# EAGLE board W952 (EAGLE 6.6.0), part 1 of 2
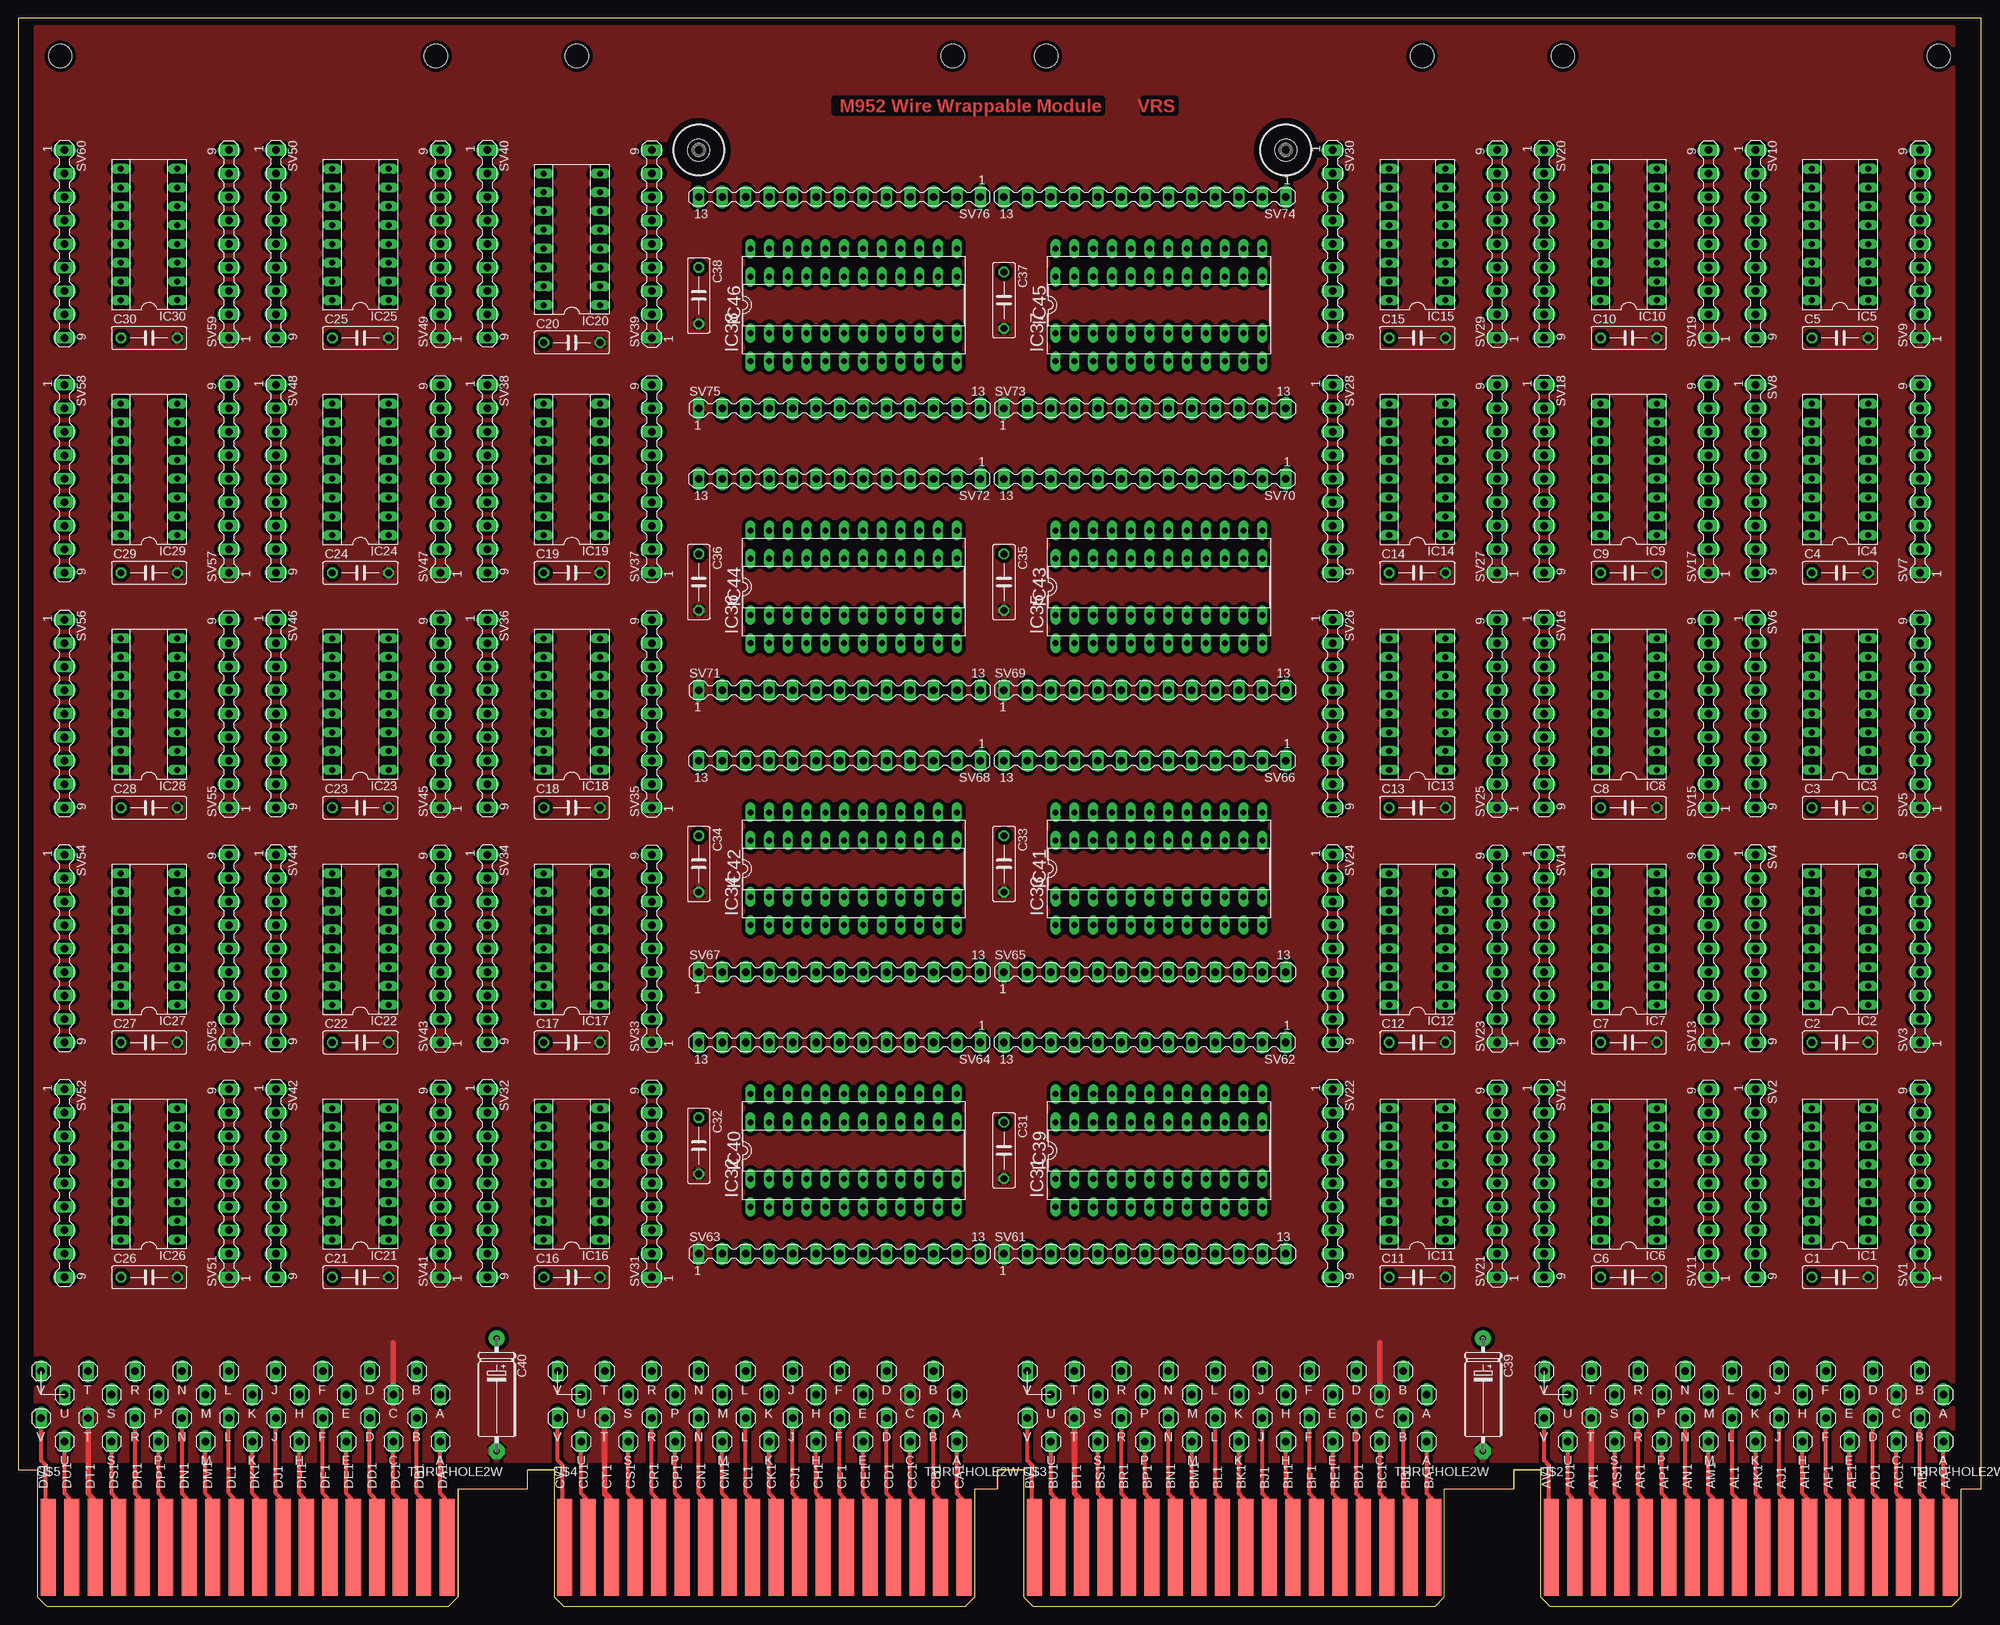
[diagram p1: board, top side]
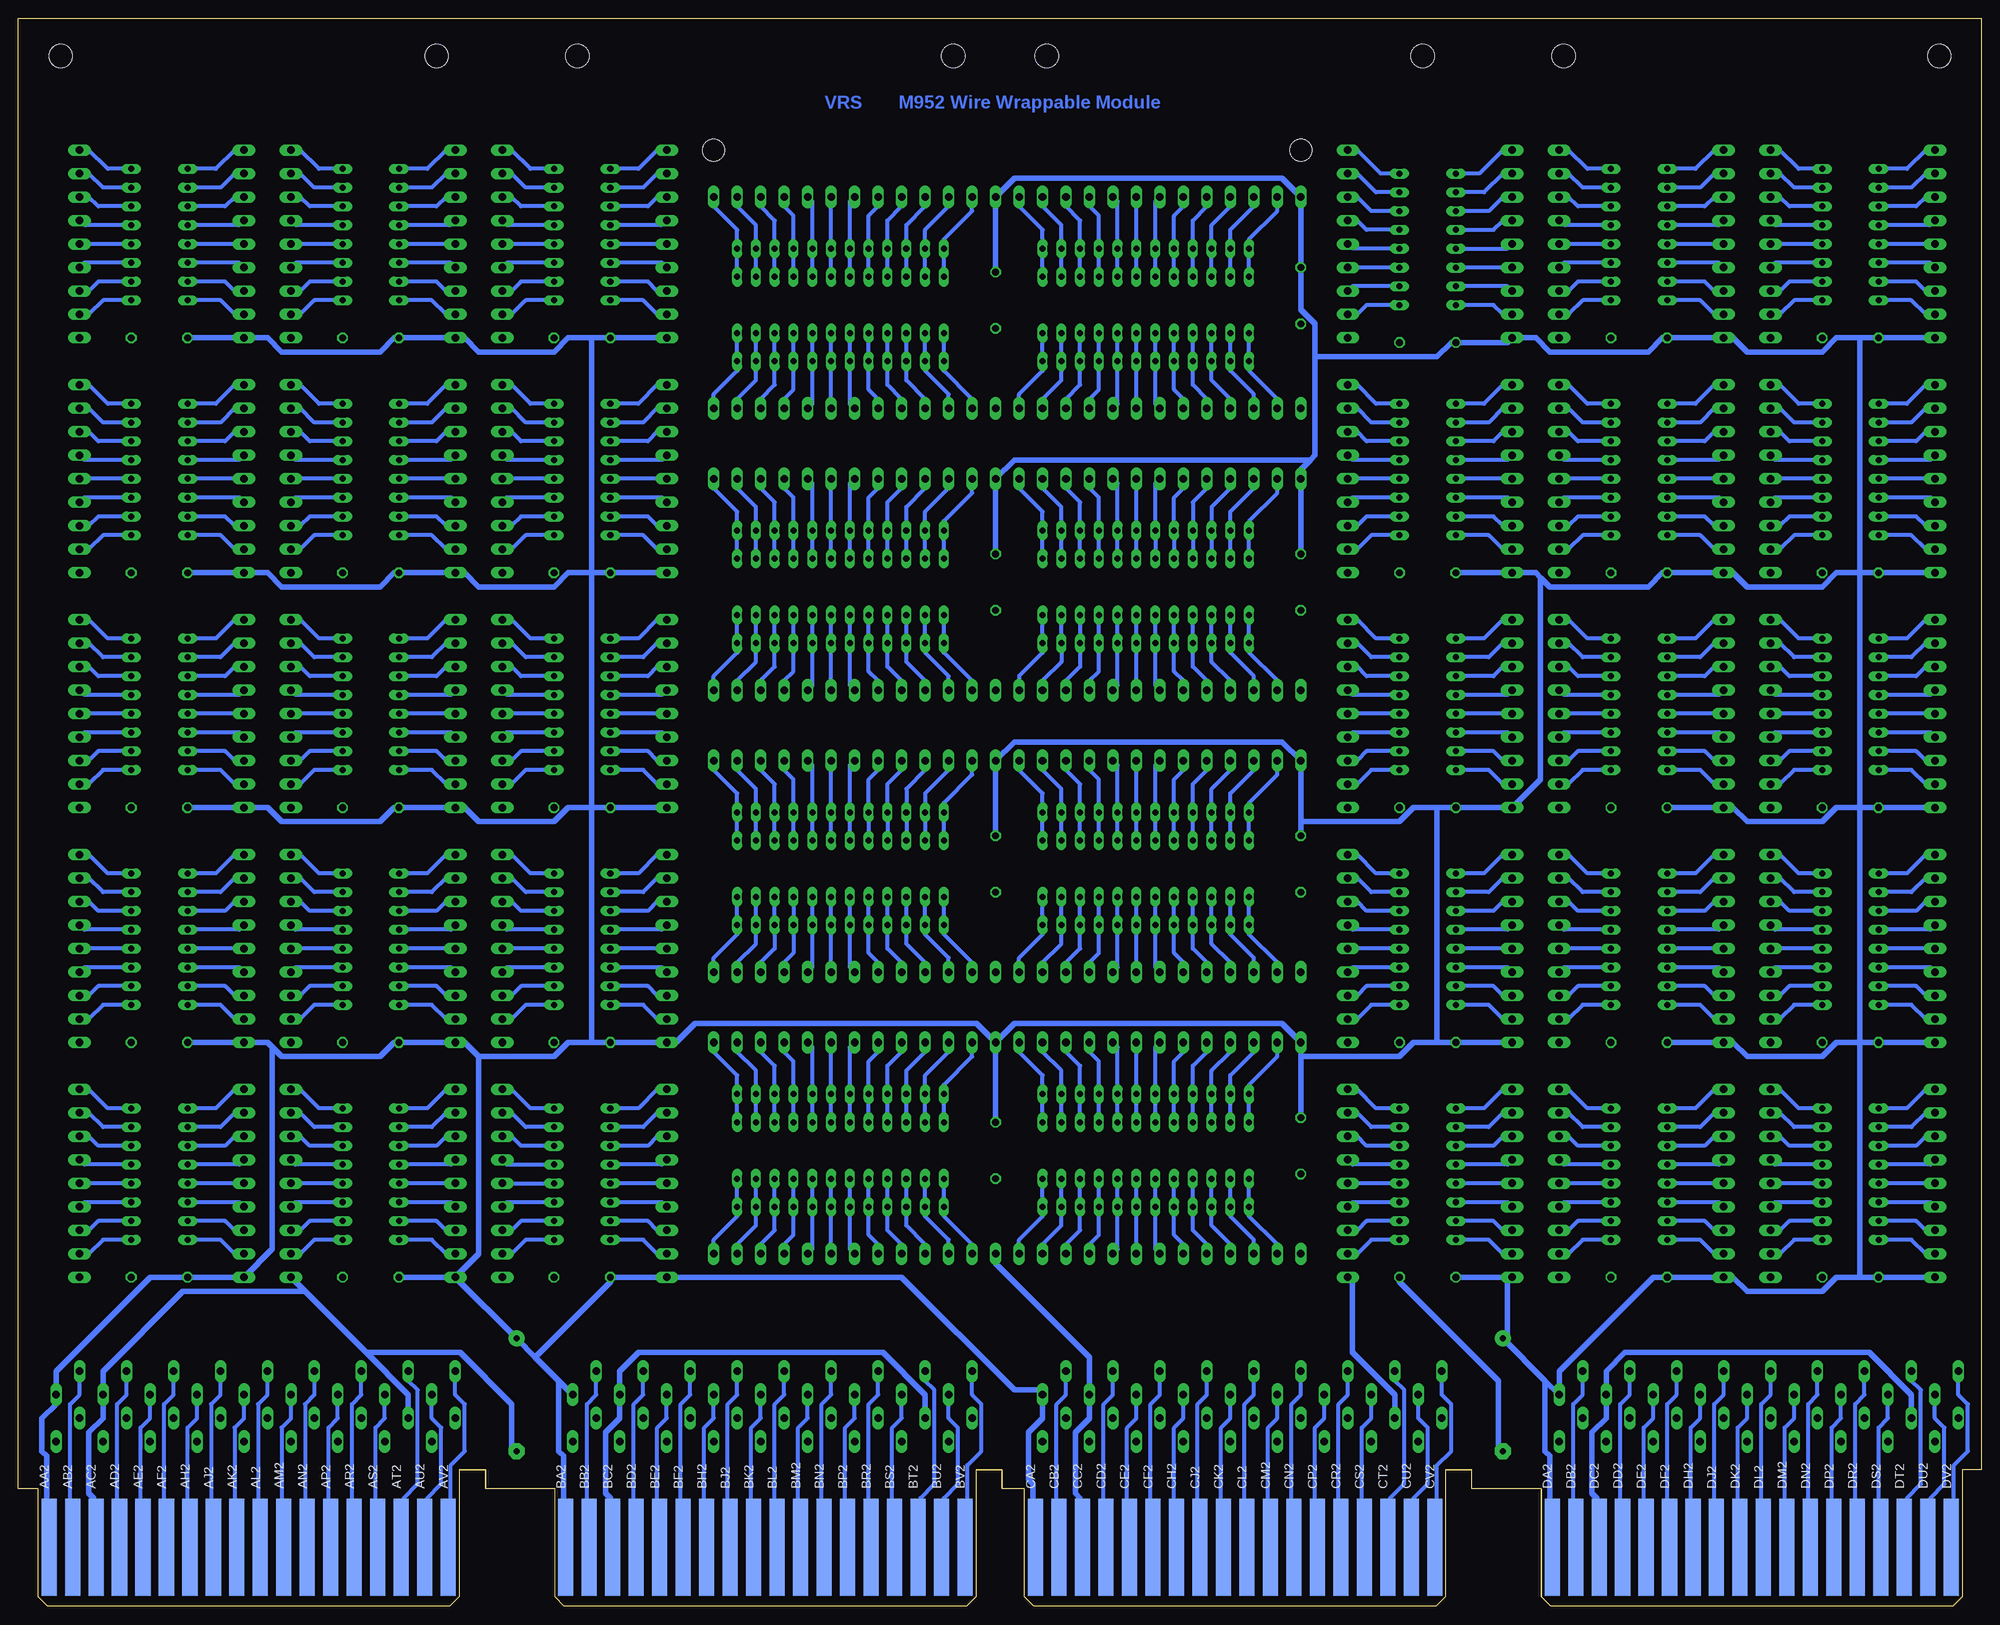
[diagram p2: board, bottom side, seen from below]

Size 265.3 x 214.63 mm. Coordinates in mm from the lower left corner, seen from the top.
Copper layers (1+16): Top 0.035mm / dielectric 1.5mm / Bottom 0.035mm
Design rules "16mils": minimum track width 16mil, minimum drill 32mil, track to track 15mil, track to pad 10mil, pad to pad 10mil, via to via 10mil, smd to smd 10mil, copper to edge 13mil, drill to drill 10mil, minimum pad ring 10mil, minimum via ring 8mil, stop-mask expansion 0mil, vias tented up to drill 0mil, thermal gap 10mil
Net classes: 0 default: width 0.508 mm; 1 supply: width 0.762 mm

## Footprints (pad centres in the part's own frame; a part is rotated, then mirrored left to right if it is on the bottom)
C075-032X103 = drill 0.914 octagon: 1 -3.81,0; 2 3.81,0
E15-5 = drill 0.813 pad 2.159: + -7.62,0 | drill 0.813 pad 2.159 octagon: - 7.62,0
SOCKET-16 = drill 0.813 long: 1 -8.89,-3.81; 2 -6.35,-3.81; 3 -3.81,-3.81; 4 -1.27,-3.81; 5 1.27,-3.81; 6 3.81,-3.81; 7 6.35,-3.81; 8 8.89,-3.81; 9 8.89,3.81; 10 6.35,3.81; 11 3.81,3.81; 12 1.27,3.81; 13 -1.27,3.81; 14 -3.81,3.81; 15 -6.35,3.81; 16 -8.89,3.81
DIL24-6 = drill 0.813 long: 1 -13.97,-7.62; 2 -11.43,-7.62; 3 -8.89,-7.62; 4 -6.35,-7.62; 5 -3.81,-7.62; 6 -1.27,-7.62; 7 1.27,-7.62; 8 3.81,-7.62; 9 6.35,-7.62; 10 8.89,-7.62; 11 11.43,-7.62; 12 13.97,-7.62; 13 13.97,7.62; 14 11.43,7.62; 15 8.89,7.62; 16 6.35,7.62; 17 3.81,7.62; 18 1.27,7.62; 19 -1.27,7.62; 20 -3.81,7.62; 21 -6.35,7.62; 22 -8.89,7.62; 23 -11.43,7.62; 24 -13.97,7.62
DIL24-3 = drill 0.813 long: 1 -13.97,-3.81; 2 -11.43,-3.81; 3 -8.89,-3.81; 4 -6.35,-3.81; 5 -3.81,-3.81; 6 -1.27,-3.81; 7 1.27,-3.81; 8 3.81,-3.81; 9 6.35,-3.81; 10 8.89,-3.81; 11 11.43,-3.81; 12 13.97,-3.81; 13 13.97,3.81; 14 11.43,3.81; 15 8.89,3.81; 16 6.35,3.81; 17 3.81,3.81; 18 1.27,3.81; 19 -1.27,3.81; 20 -3.81,3.81; 21 -6.35,3.81; 22 -8.89,3.81; 23 -11.43,3.81; 24 -13.97,3.81
MA09-1 = drill 1.016 long: 1 -12.7,0; 2 -9.525,0; 3 -6.35,0; 4 -3.175,0; 5 0,0; 6 3.175,0; 7 6.35,0; 8 9.525,0; 9 12.7,0
MA13-1 = drill 1.016 long: 1 -19.05,0; 2 -15.875,0; 3 -12.7,0; 4 -9.525,0; 5 -6.35,0; 6 -3.175,0; 7 0,0; 8 3.175,0; 9 6.35,0; 10 9.525,0; 11 12.7,0; 12 15.875,0; 13 19.05,0
EDGE-CON8 = smd 2.032 x 13.106: AA1 261.303,7.938; AB1 258.127,7.938; AC1 254.952,7.938; AD1 251.778,7.938; AE1 248.602,7.938; AF1 245.428,7.938; AH1 242.252,7.938; AJ1 239.077,7.938; AK1 235.903,7.938; AL1 232.727,7.938; AM1 229.553,7.938; AN1 226.377,7.938; AP1 223.202,7.938; AR1 220.028,7.938; AS1 216.852,7.938; AT1 213.678,7.938; AU1 210.502,7.938; AV1 207.327,7.938; BA1 191.452,7.938; BB1 188.278,7.938; BC1 185.102,7.938; BD1 181.928,7.938; BE1 178.752,7.938; BF1 175.577,7.938; BH1 172.403,7.938; BJ1 169.227,7.938; BK1 166.053,7.938; BL1 162.877,7.938; BM1 159.702,7.938; BN1 156.528,7.938; BP1 153.352,7.938; BR1 150.178,7.938; BS1 147.002,7.938; BT1 143.827,7.938; BU1 140.653,7.938; BV1 137.477,7.938; CA1 127.953,7.938; CB1 124.778,7.938; CC1 121.603,7.938; CD1 118.427,7.938; CE1 115.252,7.938; CF1 112.078,7.938; CH1 108.903,7.938; CJ1 105.728,7.938; CK1 102.552,7.938; CL1 99.377,7.938; CM1 96.203,7.938; CN1 93.028,7.938; CP1 89.853,7.938; CR1 86.677,7.938; CS1 83.502,7.938; CT1 80.328,7.938; CU1 77.153,7.938; CV1 73.978,7.938; DA1 58.102,7.938; DB1 54.928,7.938; DC1 51.752,7.938; DD1 48.578,7.938; DE1 45.403,7.938; DF1 42.227,7.938; DH1 39.053,7.938; DJ1 35.877,7.938; DK1 32.703,7.938; DL1 29.527,7.938; DM1 26.352,7.938; DN1 23.177,7.938; DP1 20.003,7.938; DR1 16.828,7.938; DS1 13.652,7.938; DT1 10.477,7.938; DU1 7.303,7.938; DV1 4.128,7.938 | smd 2.032 x 13.106 bottom: AA2 261.303,7.938; AB2 258.127,7.938; AC2 254.952,7.938; AD2 251.778,7.938; AE2 248.602,7.938; AF2 245.428,7.938; AH2 242.252,7.938; AJ2 239.077,7.938; AK2 235.903,7.938; AL2 232.727,7.938; AM2 229.553,7.938; AN2 226.377,7.938; AP2 223.202,7.938; AR2 220.028,7.938; AS2 216.852,7.938; AT2 213.678,7.938; AU2 210.502,7.938; AV2 207.327,7.938; BA2 191.452,7.938; BB2 188.278,7.938; BC2 185.102,7.938; BD2 181.928,7.938; BE2 178.752,7.938; BF2 175.577,7.938; BH2 172.403,7.938; BJ2 169.227,7.938; BK2 166.053,7.938; BL2 162.877,7.938; BM2 159.702,7.938; BN2 156.528,7.938; BP2 153.352,7.938; BR2 150.178,7.938; BS2 147.002,7.938; BT2 143.827,7.938; BU2 140.653,7.938; BV2 137.477,7.938; CA2 127.953,7.938; CB2 124.778,7.938; CC2 121.603,7.938; CD2 118.427,7.938; CE2 115.252,7.938; CF2 112.078,7.938; CH2 108.903,7.938; CJ2 105.728,7.938; CK2 102.552,7.938; CL2 99.377,7.938; CM2 96.203,7.938; CN2 93.028,7.938; CP2 89.853,7.938; CR2 86.677,7.938; CS2 83.502,7.938; CT2 80.328,7.938; CU2 77.153,7.938; CV2 73.978,7.938; DA2 58.102,7.938; DB2 54.928,7.938; DC2 51.752,7.938; DD2 48.578,7.938; DE2 45.403,7.938; DF2 42.227,7.938; DH2 39.053,7.938; DJ2 35.877,7.938; DK2 32.703,7.938; DL2 29.527,7.938; DM2 26.352,7.938; DN2 23.177,7.938; DP2 20.003,7.938; DR2 16.828,7.938; DS2 13.652,7.938; DT2 10.477,7.938; DU2 7.303,7.938; DV2 4.128,7.938
THRU-HOLE2 = drill 1.016 long: A1 28.575,9.525; A2 28.575,3.175; B1 25.4,12.7; B2 25.4,6.35; C1 22.225,9.525; C2 22.225,3.175; D1 19.05,12.7; D2 19.05,6.35; E1 15.875,9.525; E2 15.875,3.175; F1 12.7,12.7; F2 12.7,6.35; H1 9.525,9.525; H2 9.525,3.175; J1 6.35,12.7; J2 6.35,6.35; K1 3.175,9.525; K2 3.175,3.175; L1 0,12.7; L2 0,6.35; M1 -3.175,9.525; M2 -3.175,3.175; N1 -6.35,12.7; N2 -6.35,6.35; P1 -9.525,9.525; P2 -9.525,3.175; R1 -12.7,12.7; R2 -12.7,6.35; S1 -15.875,9.525; S2 -15.875,3.175; T1 -19.05,12.7; T2 -19.05,6.35; U1 -22.225,9.525; U2 -22.225,3.175; V1 -25.4,12.7; V2 -25.4,6.35
OMNIBUS = hole 3.175: 208.915,209.55; 259.715,209.55; 189.865,209.55; 139.065,209.55; 75.616,209.55; 126.416,209.55; 56.566,209.55; 5.766,209.55
DRIL-3 = hole 3: 0,0

## Placement (x,y rotation side)
C1  [C075-032X103]  246.25,44.45 0 top
C2  [C075-032X103]  246.25,76.2 0 top
C3  [C075-032X103]  246.25,107.95 0 top
C4  [C075-032X103]  246.25,139.7 0 top
C5  [C075-032X103]  246.25,171.45 0 top
C6  [C075-032X103]  217.68,44.45 0 top
C7  [C075-032X103]  217.68,76.2 0 top
C8  [C075-032X103]  217.68,107.95 0 top
C9  [C075-032X103]  217.68,139.7 0 top
C10  [C075-032X103]  217.68,171.45 0 top
C11  [C075-032X103]  189.1,44.45 0 top
C12  [C075-032X103]  189.1,76.2 0 top
C13  [C075-032X103]  189.1,107.95 0 top
C14  [C075-032X103]  189.1,139.7 0 top
C15  [C075-032X103]  189.1,171.45 0 top
C16  [C075-032X103]  74.8,44.45 0 top
C17  [C075-032X103]  74.8,76.2 0 top
C18  [C075-032X103]  74.8,107.95 0 top
C19  [C075-032X103]  74.8,139.7 0 top
C20  [C075-032X103]  74.8,170.81 0 top
C21  [C075-032X103]  46.23,44.45 0 top
C22  [C075-032X103]  46.23,76.2 0 top
C23  [C075-032X103]  46.23,107.95 0 top
C24  [C075-032X103]  46.23,139.7 0 top
C25  [C075-032X103]  46.23,171.45 0 top
C26  [C075-032X103]  17.65,44.45 0 top
C27  [C075-032X103]  17.65,76.2 0 top
C28  [C075-032X103]  17.65,107.95 0 top
C29  [C075-032X103]  17.65,139.7 0 top
C30  [C075-032X103]  17.65,171.45 0 top
C31  [C075-032X103]  133.22,61.59 270 top
C32  [C075-032X103]  91.95,62.23 270 top
C33  [C075-032X103]  133.22,100.33 270 top
C34  [C075-032X103]  91.95,100.33 270 top
C35  [C075-032X103]  133.22,138.43 270 top
C36  [C075-032X103]  91.95,138.43 270 top
C37  [C075-032X103]  133.22,176.53 270 top
C38  [C075-032X103]  91.95,177.16 270 top
C39  [E15-5]  197.99,28.57 270 top
C40  [E15-5]  64.64,28.57 270 top
IC1  [SOCKET-16]  246.25,58.42 90 top
IC2  [SOCKET-16]  246.25,90.17 90 top
IC3  [SOCKET-16]  246.25,121.92 90 top
IC4  [SOCKET-16]  246.25,153.67 90 top
IC5  [SOCKET-16]  246.25,185.42 90 top
IC6  [SOCKET-16]  217.68,58.42 90 top
IC7  [SOCKET-16]  217.68,90.17 90 top
IC8  [SOCKET-16]  217.68,121.92 90 top
IC9  [SOCKET-16]  217.68,153.67 90 top
IC10  [SOCKET-16]  217.68,185.42 90 top
IC11  [SOCKET-16]  189.1,58.42 90 top
IC12  [SOCKET-16]  189.1,90.17 90 top
IC13  [SOCKET-16]  189.1,121.92 90 top
IC14  [SOCKET-16]  189.1,153.67 90 top
IC15  [SOCKET-16]  189.1,185.42 90 top
IC16  [SOCKET-16]  74.8,58.42 90 top
IC17  [SOCKET-16]  74.8,90.17 90 top
IC18  [SOCKET-16]  74.8,121.92 90 top
IC19  [SOCKET-16]  74.8,153.67 90 top
IC20  [SOCKET-16]  74.8,184.78 90 top
IC21  [SOCKET-16]  46.23,58.42 90 top
IC22  [SOCKET-16]  46.23,90.17 90 top
IC23  [SOCKET-16]  46.23,121.92 90 top
IC24  [SOCKET-16]  46.23,153.67 90 top
IC25  [SOCKET-16]  46.23,185.42 90 top
IC26  [SOCKET-16]  17.65,58.42 90 top
IC27  [SOCKET-16]  17.65,90.17 90 top
IC28  [SOCKET-16]  17.65,121.92 90 top
IC29  [SOCKET-16]  17.65,153.67 90 top
IC30  [SOCKET-16]  17.65,185.42 90 top
IC31  [DIL24-6]  154.18,61.59 0 top
IC32  [DIL24-6]  112.9,61.59 0 top
IC33  [DIL24-6]  154.18,99.69 0 top
IC34  [DIL24-6]  112.9,99.69 0 top
IC35  [DIL24-6]  154.18,137.79 0 top
IC36  [DIL24-6]  112.9,137.79 0 top
IC37  [DIL24-6]  154.18,175.9 0 top
IC38  [DIL24-6]  112.9,175.9 0 top
IC39  [DIL24-3]  154.18,61.59 0 top
IC40  [DIL24-3]  112.9,61.59 0 top
IC41  [DIL24-3]  154.18,99.69 0 top
IC42  [DIL24-3]  112.9,99.69 0 top
IC43  [DIL24-3]  154.18,137.79 0 top
IC44  [DIL24-3]  112.9,137.79 0 top
IC45  [DIL24-3]  154.18,175.9 0 top
IC46  [DIL24-3]  112.9,175.9 0 top
SV1  MA09-1  [MA09-1]  257.05,57.15 90 top
SV2  MA09-1  [MA09-1]  234.82,57.15 270 top
SV3  MA09-1  [MA09-1]  257.05,88.9 90 top
SV4  MA09-1  [MA09-1]  234.82,88.9 270 top
SV5  MA09-1  [MA09-1]  257.05,120.65 90 top
SV6  MA09-1  [MA09-1]  234.82,120.65 270 top
SV7  MA09-1  [MA09-1]  257.05,152.4 90 top
SV8  MA09-1  [MA09-1]  234.82,152.4 270 top
SV9  MA09-1  [MA09-1]  257.05,184.15 90 top
SV10  MA09-1  [MA09-1]  234.82,184.15 270 top
SV11  MA09-1  [MA09-1]  228.47,57.15 90 top
SV12  MA09-1  [MA09-1]  206.25,57.15 270 top
SV13  MA09-1  [MA09-1]  228.47,88.9 90 top
SV14  MA09-1  [MA09-1]  206.25,88.9 270 top
SV15  MA09-1  [MA09-1]  228.47,120.65 90 top
SV16  MA09-1  [MA09-1]  206.25,120.65 270 top
SV17  MA09-1  [MA09-1]  228.47,152.4 90 top
SV18  MA09-1  [MA09-1]  206.25,152.4 270 top
SV19  MA09-1  [MA09-1]  228.47,184.15 90 top
SV20  MA09-1  [MA09-1]  206.25,184.15 270 top
SV21  MA09-1  [MA09-1]  199.9,57.15 90 top
SV22  MA09-1  [MA09-1]  177.67,57.15 270 top
SV23  MA09-1  [MA09-1]  199.9,88.9 90 top
SV24  MA09-1  [MA09-1]  177.67,88.9 270 top
SV25  MA09-1  [MA09-1]  199.9,120.65 90 top
SV26  MA09-1  [MA09-1]  177.67,120.65 270 top
SV27  MA09-1  [MA09-1]  199.9,152.4 90 top
SV28  MA09-1  [MA09-1]  177.67,152.4 270 top
SV29  MA09-1  [MA09-1]  199.9,184.15 90 top
SV30  MA09-1  [MA09-1]  177.67,184.15 270 top
SV31  MA09-1  [MA09-1]  85.6,57.15 90 top
SV32  MA09-1  [MA09-1]  63.37,57.15 270 top
SV33  MA09-1  [MA09-1]  85.6,88.9 90 top
SV34  MA09-1  [MA09-1]  63.37,88.9 270 top
SV35  MA09-1  [MA09-1]  85.6,120.65 90 top
SV36  MA09-1  [MA09-1]  63.37,120.65 270 top
SV37  MA09-1  [MA09-1]  85.6,152.4 90 top
SV38  MA09-1  [MA09-1]  63.37,152.4 270 top
SV39  MA09-1  [MA09-1]  85.6,184.15 90 top
SV40  MA09-1  [MA09-1]  63.37,184.15 270 top
SV41  MA09-1  [MA09-1]  57.02,57.15 90 top
SV42  MA09-1  [MA09-1]  34.8,57.15 270 top
SV43  MA09-1  [MA09-1]  57.02,88.9 90 top
SV44  MA09-1  [MA09-1]  34.8,88.9 270 top
SV45  MA09-1  [MA09-1]  57.02,120.65 90 top
SV46  MA09-1  [MA09-1]  34.8,120.65 270 top
SV47  MA09-1  [MA09-1]  57.02,152.4 90 top
SV48  MA09-1  [MA09-1]  34.8,152.4 270 top
SV49  MA09-1  [MA09-1]  57.02,184.15 90 top
SV50  MA09-1  [MA09-1]  34.8,184.15 270 top
SV51  MA09-1  [MA09-1]  28.45,57.15 90 top
SV52  MA09-1  [MA09-1]  6.22,57.15 270 top
SV53  MA09-1  [MA09-1]  28.45,88.9 90 top
SV54  MA09-1  [MA09-1]  6.22,88.9 270 top
SV55  MA09-1  [MA09-1]  28.45,120.65 90 top
SV56  MA09-1  [MA09-1]  6.22,120.65 270 top
SV57  MA09-1  [MA09-1]  28.45,152.4 90 top
SV58  MA09-1  [MA09-1]  6.22,152.4 270 top
SV59  MA09-1  [MA09-1]  28.45,184.15 90 top
SV60  MA09-1  [MA09-1]  6.22,184.15 270 top
SV61  MA13-1  [MA13-1]  152.27,47.62 0 top
SV62  MA13-1  [MA13-1]  152.27,76.2 180 top
SV63  MA13-1  [MA13-1]  111,47.62 0 top
SV64  MA13-1  [MA13-1]  111,76.2 180 top
SV65  MA13-1  [MA13-1]  152.27,85.72 0 top
SV66  MA13-1  [MA13-1]  152.27,114.3 180 top
SV67  MA13-1  [MA13-1]  111,85.72 0 top
SV68  MA13-1  [MA13-1]  111,114.3 180 top
SV69  MA13-1  [MA13-1]  152.27,123.83 0 top
SV70  MA13-1  [MA13-1]  152.27,152.4 180 top
SV71  MA13-1  [MA13-1]  111,123.83 0 top
SV72  MA13-1  [MA13-1]  111,152.4 180 top
SV73  MA13-1  [MA13-1]  152.27,161.93 0 top
SV74  MA13-1  [MA13-1]  152.27,190.5 180 top
SV75  MA13-1  [MA13-1]  111,161.93 0 top
SV76  MA13-1  [MA13-1]  111,190.5 180 top
U$1  [EDGE-CON8]  -0.13,0 0 top
U$2  THRU-HOLE2W  [THRU-HOLE2]  231.65,19.05 0 top
U$3  THRU-HOLE2W  [THRU-HOLE2]  161.8,19.05 0 top
U$4  THRU-HOLE2W  [THRU-HOLE2]  98.3,19.05 0 top
U$5  THRU-HOLE2W  [THRU-HOLE2]  28.45,19.05 0 top
U$8  OUTLINE-OMNIBUS  [OMNIBUS]  -0.13,0 0 top
U$9  [DRIL-3]  91.95,196.85 0 top
U$10  [DRIL-3]  171.32,196.85 0 top

## Tracks (layer width: path | path; a pad name or v marks a point on that pad's centre or on a via)
GND
  Top 0.762: U$3.T2 142.75,15.24 143.38,14.61 U$1.BT1 | U$5.T2 9.4,15.24 10.03,14.61 U$1.DT1 | U$1.CT1 79.88,14.61 79.25,15.24 U$4.T2 | U$1.AT1 213.23,14.61 212.6,15.24 U$2.T2 | U$5.C1 50.67,35.56 | U$3.C1 184.02,35.56
  Bottom 0.762: U$1.BC2 185.29,14.61 185.93,15.24 185.93,23.5 184.02,25.4 U$3.C1 184.02,31.75 181.48,34.29 148.46,34.29 142.75,28.57 U$3.T2 | U$1.DC2 51.94,14.61 52.58,15.24 52.58,23.5 50.67,25.4 U$5.C1 50.67,31.75 48.13,34.29 15.11,34.29 9.4,28.57 U$5.T2 | U$1.AC2 255.14,14.61 255.78,15.24 255.78,23.5 253.87,25.4 U$2.C1 253.87,31.75 243.08,42.55 226.57,42.55 | U$1.CC2 121.79,14.61 122.43,15.24 122.43,23.5 120.52,25.4 U$4.C1 120.52,33.66 133.22,46.35 SV61.1 | U$4.T2 79.25,28.57 84.96,34.29 84.96,43.81 SV31.1 | 226.57,42.55 218.31,34.29 | 218.31,34.29 212.6,28.57 U$2.T2 | 226.57,42.55 SV11.1 | C40.- 65.28,21.59 65.28,30.48 78.61,43.81 C16.2 | 218.31,34.29 205.61,34.29 198.63,27.3 198.63,21.59 C39.-
  pour Top (isolate 0.508): 2.41,19.68 261.49,19.68 261.49,213.36 2.41,213.36
N$1
  Top 0.508: U$2.K2 234.82,15.24 235.46,14.61 U$1.AK1
N$2
  Top 0.508: U$2.J2 238,15.24 238.63,14.61 U$1.AJ1
N$3
  Top 0.508: U$2.H2 241.17,15.24 241.81,14.61 U$1.AH1
N$4
  Top 0.508: U$2.L2 231.65,15.24 232.28,14.61 U$1.AL1
N$5
  Top 0.508: U$2.M2 228.47,15.24 229.11,14.61 U$1.AM1
N$6
  Top 0.508: U$2.N2 225.3,15.24 225.93,14.61 U$1.AN1
N$7
  Top 0.508: U$2.P2 222.12,15.24 222.76,14.61 U$1.AP1
N$8
  Top 0.508: U$2.F2 244.35,15.24 244.98,14.61 U$1.AF1
N$9
  Top 0.508: U$2.E2 247.52,15.24 248.16,14.61 U$1.AE1
N$10
  Top 0.508: U$2.D2 250.7,15.24 251.33,14.61 U$1.AD1
N$11
  Top 0.508: U$2.C2 253.87,15.24 254.51,14.61 U$1.AC1
N$12
  Top 0.508: U$2.R2 218.95,15.24 219.58,14.61 U$1.AR1
N$13
  Top 0.508: U$2.S2 215.77,15.24 216.41,14.61 U$1.AS1
N$14
  Top 0.508: U$2.B2 257.05,15.24 257.68,14.61 U$1.AB1
N$15
  Top 0.508: U$2.A2 260.22,15.24 260.86,14.61 U$1.AA1
N$16
  Top 0.508: U$2.U2 209.42,15.24 210.06,14.61 U$1.AU1
N$17
  Top 0.508: U$2.V2 206.25,19.68 206.88,19.05 206.88,13.97 U$1.AV1
N$18
  Bottom 0.508: U$2.V1 206.25,28.57 204.98,27.3 204.98,20.95 206.88,19.05 206.88,13.97 U$1.AV2
N$19
  Bottom 0.508: U$2.U1 209.42,25.4 208.15,24.13 208.15,16.51 210.06,14.61 U$1.AU2
N$20
  Bottom 0.508: U$2.T1 212.6,30.48 211.33,29.21 211.33,16.51 213.23,14.61 U$1.AT2
N$21
  Bottom 0.508: U$2.S1 215.77,25.4 217.04,24.13 217.04,13.97 U$1.AS2
N$22
  Bottom 0.508: U$2.R1 218.95,28.57 220.22,27.3 220.22,13.97 U$1.AR2
N$23
  Bottom 0.508: U$2.P1 222.12,25.4 223.39,24.13 223.39,13.97 U$1.AP2
N$24
  Bottom 0.508: U$2.N1 225.3,28.57 226.57,27.3 226.57,13.97 U$1.AN2
N$25
  Bottom 0.508: U$2.M1 228.47,25.4 229.74,24.13 229.74,13.97 U$1.AM2
N$26
  Bottom 0.508: U$2.L1 231.65,28.57 232.92,27.3 232.92,13.97 U$1.AL2
N$27
  Bottom 0.508: U$2.K1 234.82,25.4 236.09,24.13 236.09,13.97 U$1.AK2
N$28
  Bottom 0.508: U$2.J1 238,28.57 239.27,27.3 239.27,13.97 U$1.AJ2
N$29
  Bottom 0.508: U$2.H1 241.17,25.4 242.44,24.13 242.44,13.97 U$1.AH2
N$30
  Bottom 0.508: U$2.F1 244.35,28.57 245.62,27.3 245.62,13.97 U$1.AF2
N$31
  Bottom 0.508: U$2.E1 247.52,25.4 248.79,24.13 248.79,13.97 U$1.AE2
N$32
  Bottom 0.508: U$2.D1 250.7,28.57 251.97,27.3 251.97,13.97 U$1.AD2
N$33
  Bottom 0.508: U$2.B1 257.05,28.57 258.32,27.3 258.32,13.97 U$1.AB2
N$34
  Top 0.508: U$3.V2 136.4,19.68 137.03,19.05 137.03,13.97 U$1.BV1
N$35
  Top 0.508: U$3.U2 139.57,15.24 140.21,14.61 U$1.BU1
N$36
  Top 0.508: U$3.S2 145.92,15.24 146.56,14.61 U$1.BS1
N$37
  Top 0.508: U$3.R2 149.1,15.24 149.73,14.61 U$1.BR1
N$38
  Top 0.508: U$3.P2 152.27,15.24 152.91,14.61 U$1.BP1
N$39
  Top 0.508: U$3.N2 155.45,15.24 156.08,14.61 U$1.BN1
N$40
  Top 0.508: U$3.M2 158.62,15.24 159.26,14.61 U$1.BM1
N$41
  Top 0.508: U$3.L2 161.8,15.24 162.43,14.61 U$1.BL1
N$42
  Top 0.508: U$3.K2 164.97,15.24 165.61,14.61 U$1.BK1
N$43
  Top 0.508: U$3.J2 168.15,15.24 168.78,14.61 U$1.BJ1
N$44
  Top 0.508: U$3.H2 171.32,15.24 171.96,14.61 U$1.BH1
N$45
  Top 0.508: U$3.F2 174.5,15.24 175.13,14.61 U$1.BF1
N$46
  Top 0.508: U$3.E2 177.67,15.24 178.31,14.61 U$1.BE1
N$47
  Top 0.508: U$3.D2 180.85,15.24 181.48,14.61 U$1.BD1
N$48
  Top 0.508: U$3.C2 184.02,15.24 184.66,14.61 U$1.BC1
N$49
  Top 0.508: U$3.B2 187.2,15.24 187.83,14.61 U$1.BB1
N$50
  Top 0.508: U$3.A2 190.37,15.24 191.01,14.61 U$1.BA1
N$51
  Bottom 0.508: U$3.V1 136.4,28.57 135.13,27.3 135.13,20.95 137.03,19.05 137.03,13.97 U$1.BV2
N$52
  Bottom 0.508: U$3.U1 139.57,25.4 138.3,24.13 138.3,16.51 140.21,14.61 U$1.BU2
N$53
  Bottom 0.508: U$3.T1 142.75,30.48 141.48,29.21 141.48,16.51 143.38,14.61 U$1.BT2
N$54
  Bottom 0.508: U$3.S1 145.92,25.4 147.19,24.13 147.19,13.97 U$1.BS2
N$55
  Bottom 0.508: U$3.R1 149.1,28.57 150.37,27.3 150.37,13.97 U$1.BR2
N$56
  Bottom 0.508: U$3.P1 152.27,25.4 153.54,24.13 153.54,13.97 U$1.BP2
N$57
  Bottom 0.508: U$3.N1 155.45,28.57 156.72,27.3 156.72,13.97 U$1.BN2
N$58
  Bottom 0.508: U$3.M1 158.62,25.4 159.89,24.13 159.89,13.97 U$1.BM2
N$59
  Bottom 0.508: U$3.L1 161.8,28.57 163.07,27.3 163.07,13.97 U$1.BL2
N$60
  Bottom 0.508: U$3.K1 164.97,25.4 166.24,24.13 166.24,13.97 U$1.BK2
N$61
  Bottom 0.508: U$3.J1 168.15,28.57 169.42,27.3 169.42,13.97 U$1.BJ2
N$62
  Bottom 0.508: U$3.H1 171.32,25.4 172.59,24.13 172.59,13.97 U$1.BH2
N$63
  Bottom 0.508: U$3.F1 174.5,28.57 175.77,27.3 175.77,13.97 U$1.BF2
N$64
  Bottom 0.508: U$3.E1 177.67,25.4 178.94,24.13 178.94,13.97 U$1.BE2
N$65
  Bottom 0.508: U$3.D1 180.85,28.57 182.12,27.3 182.12,13.97 U$1.BD2
N$66
  Bottom 0.508: U$3.B1 187.2,28.57 188.47,27.3 188.47,13.97 U$1.BB2
N$67
  Top 0.508: U$4.V2 72.9,19.68 73.53,19.05 73.53,13.97 U$1.CV1
N$68
  Top 0.508: U$4.U2 76.07,15.24 76.71,14.61 U$1.CU1
N$69
  Top 0.508: U$4.S2 82.42,15.24 83.06,14.61 U$1.CS1
N$70
  Top 0.508: U$4.R2 85.6,15.24 86.23,14.61 U$1.CR1
N$71
  Top 0.508: U$4.P2 88.77,15.24 89.41,14.61 U$1.CP1
N$72
  Top 0.508: U$4.N2 91.95,15.24 92.58,14.61 U$1.CN1
N$73
  Top 0.508: U$4.M2 95.12,15.24 95.76,14.61 U$1.CM1
N$74
  Top 0.508: U$4.L2 98.3,15.24 98.93,14.61 U$1.CL1
N$75
  Top 0.508: U$4.K2 101.47,15.24 102.11,14.61 U$1.CK1
N$76
  Top 0.508: U$4.J2 104.65,15.24 105.28,14.61 U$1.CJ1
N$77
  Top 0.508: U$4.H2 107.82,15.24 108.46,14.61 U$1.CH1
N$78
  Top 0.508: U$4.F2 111,15.24 111.63,14.61 U$1.CF1
N$79
  Top 0.508: U$4.E2 114.17,15.24 114.81,14.61 U$1.CE1
N$80
  Top 0.508: U$4.D2 117.35,15.24 117.98,14.61 U$1.CD1
N$81
  Top 0.508: U$4.C2 120.52,15.24 121.16,14.61 U$1.CC1
N$82
  Top 0.508: U$4.B2 123.7,15.24 124.33,14.61 U$1.CB1
N$83
  Top 0.508: U$4.A2 126.87,15.24 127.51,14.61 U$1.CA1
N$84
  Bottom 0.508: U$4.V1 72.9,28.57 71.63,27.3 71.63,20.95 73.53,19.05 73.53,13.97 U$1.CV2
N$85
  Bottom 0.508: U$4.U1 76.07,25.4 74.8,24.13 74.8,16.51 76.07,15.24 76.71,14.61 U$1.CU2
N$86
  Bottom 0.508: U$4.T1 79.25,30.48 77.98,29.21 77.98,16.51 79.88,14.61 U$1.CT2
N$87
  Bottom 0.508: U$4.S1 82.42,25.4 83.69,24.13 83.69,13.97 U$1.CS2
N$88
  Bottom 0.508: U$4.R1 85.6,28.57 86.87,27.3 86.87,13.97 U$1.CR2
N$89
  Bottom 0.508: U$4.P1 88.77,25.4 90.04,24.13 90.04,13.97 U$1.CP2
N$90
  Bottom 0.508: U$4.N1 91.95,28.57 93.22,27.3 93.22,13.97 U$1.CN2
N$91
  Bottom 0.508: U$4.M1 95.12,25.4 96.39,24.13 96.39,13.97 U$1.CM2
N$92
  Bottom 0.508: U$4.L1 98.3,28.57 99.57,27.3 99.57,13.97 U$1.CL2
N$93
  Bottom 0.508: U$4.K1 101.47,25.4 102.74,24.13 102.74,13.97 U$1.CK2
N$94
  Bottom 0.508: U$4.J1 104.65,28.57 105.92,27.3 105.92,13.97 U$1.CJ2
N$95
  Bottom 0.508: U$4.H1 107.82,25.4 109.09,24.13 109.09,13.97 U$1.CH2
N$96
  Bottom 0.508: U$4.F1 111,28.57 112.27,27.3 112.27,13.97 U$1.CF2
N$97
  Bottom 0.508: U$4.E1 114.17,25.4 115.44,24.13 115.44,13.97 U$1.CE2
N$98
  Bottom 0.508: U$4.D1 117.35,28.57 118.62,27.3 118.62,13.97 U$1.CD2
N$99
  Bottom 0.508: U$4.B1 123.7,28.57 124.97,27.3 124.97,13.97 U$1.CB2
N$100
  Top 0.508: U$5.V2 3.05,19.68 3.68,19.05 3.68,13.97 U$1.DV1
N$101
  Top 0.508: U$5.U2 6.22,15.24 6.86,14.61 U$1.DU1
N$102
  Top 0.508: U$5.S2 12.57,15.24 13.21,14.61 U$1.DS1
N$103
  Top 0.508: U$5.R2 15.75,15.24 16.38,14.61 U$1.DR1
N$104
  Top 0.508: U$5.P2 18.92,15.24 19.56,14.61 U$1.DP1
N$105
  Top 0.508: U$5.N2 22.1,15.24 22.73,14.61 U$1.DN1
N$106
  Top 0.508: U$5.M2 25.27,15.24 25.91,14.61 U$1.DM1
N$107
  Top 0.508: U$5.L2 28.45,15.24 29.08,14.61 U$1.DL1
N$108
  Top 0.508: U$5.K2 31.62,15.24 32.26,14.61 U$1.DK1
N$109
  Top 0.508: U$5.J2 34.8,15.24 35.43,14.61 U$1.DJ1
N$110
  Top 0.508: U$5.H2 37.97,15.24 38.61,14.61 U$1.DH1
N$111
  Top 0.508: U$5.F2 41.15,15.24 41.78,14.61 U$1.DF1
N$112
  Top 0.508: U$5.E2 44.32,15.24 44.96,14.61 U$1.DE1
N$113
  Top 0.508: U$5.D2 47.5,15.24 48.13,14.61 U$1.DD1
N$114
  Top 0.508: U$5.C2 50.67,15.24 51.31,14.61 U$1.DC1
N$115
  Top 0.508: U$5.B2 53.85,15.24 54.48,14.61 U$1.DB1
N$116
  Top 0.508: U$5.A2 57.02,15.24 57.66,14.61 U$1.DA1
N$117
  Bottom 0.508: U$5.V1 3.05,28.57 1.78,27.3 1.78,20.95 3.68,19.05 3.68,13.97 U$1.DV2
N$118
  Bottom 0.508: U$5.U1 6.22,25.4 4.95,24.13 4.95,16.51 6.86,14.61 U$1.DU2
N$119
  Bottom 0.508: U$5.T1 9.4,30.48 8.13,29.21 8.13,16.51 10.03,14.61 U$1.DT2
N$120
  Bottom 0.508: U$5.S1 12.57,25.4 13.84,24.13 13.84,13.97 U$1.DS2
N$121
  Bottom 0.508: U$5.R1 15.75,28.57 17.02,27.3 17.02,13.97 U$1.DR2
N$122
  Bottom 0.508: U$5.P1 18.92,25.4 20.19,24.13 20.19,13.97 U$1.DP2
N$123
  Bottom 0.508: U$5.N1 22.1,28.57 23.37,27.3 23.37,13.97 U$1.DN2
N$124
  Bottom 0.508: U$5.M1 25.27,25.4 26.54,24.13 26.54,13.97 U$1.DM2
N$125
  Bottom 0.508: U$5.L1 28.45,28.57 29.72,27.3 29.72,13.97 U$1.DL2
N$126
  Bottom 0.508: U$5.K1 31.62,25.4 32.89,24.13 32.89,13.97 U$1.DK2
N$127
  Bottom 0.508: U$5.J1 34.8,28.57 36.07,27.3 36.07,13.97 U$1.DJ2
N$128
  Bottom 0.508: U$5.H1 37.97,25.4 39.24,24.13 39.24,13.97 U$1.DH2
N$129
  Bottom 0.508: U$5.F1 41.15,28.57 42.42,27.3 42.42,13.97 U$1.DF2
N$130
  Bottom 0.508: U$5.E1 44.32,25.4 45.59,24.13 45.59,13.97 U$1.DE2
N$131
  Bottom 0.508: U$5.D1 47.5,28.57 48.77,27.3 48.77,13.97 U$1.DD2
N$132
  Bottom 0.508: U$5.B1 53.85,28.57 55.12,27.3 55.12,13.97 U$1.DB2
N$133
  Bottom 0.508: IC1.1 253.87,49.53 255.78,47.62 SV1.2
N$134
  Bottom 0.508: IC1.2 254.51,52.07 255.78,50.8 SV1.3
N$135
  Bottom 0.508: IC1.3 256.41,54.61 SV1.4
N$136
  Bottom 0.508: IC1.4 SV1.5
N$137
  Bottom 0.508: IC1.5 256.41,59.69 SV1.6
N$138
  Bottom 0.508: IC1.6 254.51,62.23 255.78,63.5 SV1.7
N$139
  Bottom 0.508: IC1.7 253.87,64.77 255.78,66.67 SV1.8
N$140
  Bottom 0.508: IC1.8 253.24,67.31 255.78,69.85 SV1.9
N$141
  Bottom 0.508: IC1.9 238.63,67.31 236.09,69.85 SV2.1
N$142
  Bottom 0.508: IC1.10 238,64.77 236.09,66.67 SV2.2
N$143
  Bottom 0.508: IC1.11 237.36,62.23 236.09,63.5 SV2.3
N$144
  Bottom 0.508: IC1.12 235.46,59.69 SV2.4
N$145
  Bottom 0.508: SV2.5 IC1.13
N$146
  Bottom 0.508: IC1.14 235.46,54.61 SV2.6
N$147
  Bottom 0.508: IC1.15 237.36,52.07 236.09,50.8 SV2.7
N$148
  Bottom 0.508: IC1.16 238,49.53 236.09,47.62 SV2.8
N$151
  Bottom 0.508: IC2.1 253.87,81.28 255.78,79.38 SV3.2
N$152
  Bottom 0.508: IC2.2 254.51,83.82 255.78,82.55 SV3.3
N$153
  Bottom 0.508: IC2.3 256.41,86.36 SV3.4
N$154
  Bottom 0.508: IC2.4 SV3.5
N$155
  Bottom 0.508: IC2.5 256.41,91.44 SV3.6
N$156
  Bottom 0.508: IC2.6 254.51,93.98 255.78,95.25 SV3.7
N$157
  Bottom 0.508: IC2.7 253.87,96.52 255.78,98.42 SV3.8
N$158
  Bottom 0.508: IC2.8 253.24,99.06 255.78,101.6 SV3.9
N$159
  Bottom 0.508: IC2.9 238.63,99.06 236.09,101.6 SV4.1
N$160
  Bottom 0.508: IC2.10 238,96.52 236.09,98.42 SV4.2
N$161
  Bottom 0.508: IC2.11 237.36,93.98 236.09,95.25 SV4.3
N$162
  Bottom 0.508: IC2.12 235.46,91.44 SV4.4
N$163
  Bottom 0.508: SV4.5 IC2.13
N$164
  Bottom 0.508: IC2.14 235.46,86.36 SV4.6
N$165
  Bottom 0.508: IC2.15 237.36,83.82 236.09,82.55 SV4.7
N$166
  Bottom 0.508: IC2.16 238,81.28 236.09,79.38 SV4.8
N$169
  Bottom 0.508: IC3.1 253.87,113.03 255.78,111.12 SV5.2
N$170
  Bottom 0.508: IC3.2 254.51,115.57 255.78,114.3 SV5.3
N$171
  Bottom 0.508: IC3.3 256.41,118.11 SV5.4
N$172
  Bottom 0.508: IC3.4 SV5.5
N$173
  Bottom 0.508: IC3.5 256.41,123.19 SV5.6
N$174
  Bottom 0.508: IC3.6 254.51,125.73 255.78,127 SV5.7
N$175
  Bottom 0.508: IC3.7 253.87,128.27 255.78,130.18 SV5.8
N$176
  Bottom 0.508: IC3.8 253.24,130.81 255.78,133.35 SV5.9
N$177
  Bottom 0.508: IC3.9 238.63,130.81 236.09,133.35 SV6.1
N$178
  Bottom 0.508: IC3.10 238,128.27 236.09,130.18 SV6.2
N$179
  Bottom 0.508: IC3.11 237.36,125.73 236.09,127 SV6.3
N$180
  Bottom 0.508: IC3.12 235.46,123.19 SV6.4
N$181
  Bottom 0.508: SV6.5 IC3.13
N$182
  Bottom 0.508: IC3.14 235.46,118.11 SV6.6
N$183
  Bottom 0.508: IC3.15 237.36,115.57 236.09,114.3 SV6.7
N$184
  Bottom 0.508: IC3.16 238,113.03 236.09,111.12 SV6.8
N$187
  Bottom 0.508: IC4.1 253.87,144.78 255.78,142.88 SV7.2
N$188
  Bottom 0.508: IC4.2 254.51,147.32 255.78,146.05 SV7.3
N$189
  Bottom 0.508: IC4.3 256.41,149.86 SV7.4
N$190
  Bottom 0.508: IC4.4 SV7.5
N$191
  Bottom 0.508: IC4.5 256.41,154.94 SV7.6
N$192
  Bottom 0.508: IC4.6 254.51,157.48 255.78,158.75 SV7.7
N$193
  Bottom 0.508: IC4.7 253.87,160.02 255.78,161.93 SV7.8
N$194
  Bottom 0.508: IC4.8 253.24,162.56 255.78,165.1 SV7.9
N$195
  Bottom 0.508: IC4.9 238.63,162.56 236.09,165.1 SV8.1
N$196
  Bottom 0.508: IC4.10 238,160.02 236.09,161.93 SV8.2
N$197
  Bottom 0.508: IC4.11 237.36,157.48 236.09,158.75 SV8.3
N$198
  Bottom 0.508: IC4.12 235.46,154.94 SV8.4
N$199
  Bottom 0.508: SV8.5 IC4.13
N$200
  Bottom 0.508: IC4.14 235.46,149.86 SV8.6
N$201
  Bottom 0.508: IC4.15 237.36,147.32 236.09,146.05 SV8.7
N$202
  Bottom 0.508: IC4.16 238,144.78 236.09,142.88 SV8.8
N$205
  Bottom 0.508: IC5.1 253.87,176.53 255.78,174.62 SV9.2
N$206
  Bottom 0.508: IC5.2 254.51,179.07 255.78,177.8 SV9.3
N$207
  Bottom 0.508: IC5.3 256.41,181.61 SV9.4
N$208
  Bottom 0.508: IC5.4 SV9.5
N$209
  Bottom 0.508: IC5.5 256.41,186.69 SV9.6
N$210
  Bottom 0.508: IC5.6 254.51,189.23 255.78,190.5 SV9.7
N$211
  Bottom 0.508: IC5.7 253.87,191.77 255.78,193.68 SV9.8
N$212
  Bottom 0.508: IC5.8 253.24,194.31 255.78,196.85 SV9.9
N$213
  Bottom 0.508: IC5.9 238.63,194.31 236.09,196.85 SV10.1
N$214
  Bottom 0.508: IC5.10 238,191.77 236.09,193.68 SV10.2
N$215
  Bottom 0.508: IC5.11 237.36,189.23 236.09,190.5 SV10.3
N$216
  Bottom 0.508: IC5.12 235.46,186.69 SV10.4
N$217
  Bottom 0.508: SV10.5 IC5.13
N$218
  Bottom 0.508: IC5.14 235.46,181.61 SV10.6
N$219
  Bottom 0.508: IC5.15 237.36,179.07 236.09,177.8 SV10.7
N$220
  Bottom 0.508: IC5.16 238,176.53 236.09,174.62 SV10.8
N$223
  Bottom 0.508: IC6.1 225.3,49.53 227.2,47.62 SV11.2
N$224
  Bottom 0.508: IC6.2 225.93,52.07 227.2,50.8 SV11.3
N$225
  Bottom 0.508: IC6.3 227.84,54.61 SV11.4
N$226
  Bottom 0.508: IC6.4 SV11.5
N$227
  Bottom 0.508: IC6.5 227.84,59.69 SV11.6
N$228
  Bottom 0.508: IC6.6 225.93,62.23 227.2,63.5 SV11.7
N$229
  Bottom 0.508: IC6.7 225.3,64.77 227.2,66.67 SV11.8
N$230
  Bottom 0.508: IC6.8 224.66,67.31 227.2,69.85 SV11.9
N$231
  Bottom 0.508: IC6.9 210.06,67.31 207.52,69.85 SV12.1
N$232
  Bottom 0.508: IC6.10 209.42,64.77 207.52,66.67 SV12.2
N$233
  Bottom 0.508: IC6.11 208.79,62.23 207.52,63.5 SV12.3
N$234
  Bottom 0.508: IC6.12 206.88,59.69 SV12.4
N$235
  Bottom 0.508: SV12.5 IC6.13
N$236
  Bottom 0.508: IC6.14 206.88,54.61 SV12.6
N$237
  Bottom 0.508: IC6.15 208.79,52.07 207.52,50.8 SV12.7
N$238
  Bottom 0.508: IC6.16 209.42,49.53 207.52,47.62 SV12.8
N$241
  Bottom 0.508: IC7.1 225.3,81.28 227.2,79.38 SV13.2
N$242
  Bottom 0.508: IC7.2 225.93,83.82 227.2,82.55 SV13.3
N$243
  Bottom 0.508: IC7.3 227.84,86.36 SV13.4
N$244
  Bottom 0.508: IC7.4 SV13.5
N$245
  Bottom 0.508: IC7.5 227.84,91.44 SV13.6
N$246
  Bottom 0.508: IC7.6 225.93,93.98 227.2,95.25 SV13.7
N$247
  Bottom 0.508: IC7.7 225.3,96.52 227.2,98.42 SV13.8
N$248
  Bottom 0.508: IC7.8 224.66,99.06 227.2,101.6 SV13.9
N$249
  Bottom 0.508: IC7.9 210.06,99.06 207.52,101.6 SV14.1
N$250
  Bottom 0.508: IC7.10 209.42,96.52 207.52,98.42 SV14.2
N$251
  Bottom 0.508: IC7.11 208.79,93.98 207.52,95.25 SV14.3
N$252
  Bottom 0.508: IC7.12 206.88,91.44 SV14.4
N$253
  Bottom 0.508: SV14.5 IC7.13
N$254
  Bottom 0.508: IC7.14 206.88,86.36 SV14.6
N$255
  Bottom 0.508: IC7.15 208.79,83.82 207.52,82.55 SV14.7
N$256
  Bottom 0.508: IC7.16 209.42,81.28 207.52,79.38 SV14.8
N$259
  Bottom 0.508: IC8.1 225.3,113.03 227.2,111.12 SV15.2
N$260
  Bottom 0.508: IC8.2 225.93,115.57 227.2,114.3 SV15.3
N$261
  Bottom 0.508: IC8.3 227.84,118.11 SV15.4
N$262
  Bottom 0.508: IC8.4 SV15.5
N$263
  Bottom 0.508: IC8.5 227.84,123.19 SV15.6
N$264
  Bottom 0.508: IC8.6 225.93,125.73 227.2,127 SV15.7
N$265
  Bottom 0.508: IC8.7 225.3,128.27 227.2,130.18 SV15.8
N$266
  Bottom 0.508: IC8.8 224.66,130.81 227.2,133.35 SV15.9
N$267
  Bottom 0.508: IC8.9 210.06,130.81 207.52,133.35 SV16.1
N$268
  Bottom 0.508: IC8.10 209.42,128.27 207.52,130.18 SV16.2
N$269
  Bottom 0.508: IC8.11 208.79,125.73 207.52,127 SV16.3
N$270
  Bottom 0.508: IC8.12 206.88,123.19 SV16.4
N$271
  Bottom 0.508: SV16.5 IC8.13
N$272
  Bottom 0.508: IC8.14 206.88,118.11 SV16.6
N$273
  Bottom 0.508: IC8.15 208.79,115.57 207.52,114.3 SV16.7
N$274
  Bottom 0.508: IC8.16 209.42,113.03 207.52,111.12 SV16.8
N$277
  Bottom 0.508: IC9.1 225.3,144.78 227.2,142.88 SV17.2
N$278
  Bottom 0.508: IC9.2 225.93,147.32 227.2,146.05 SV17.3
N$279
  Bottom 0.508: IC9.3 227.84,149.86 SV17.4
N$280
  Bottom 0.508: IC9.4 SV17.5
N$281
  Bottom 0.508: IC9.5 227.84,154.94 SV17.6
N$282
  Bottom 0.508: IC9.6 225.93,157.48 227.2,158.75 SV17.7
N$283
  Bottom 0.508: IC9.7 225.3,160.02 227.2,161.93 SV17.8
N$284
  Bottom 0.508: IC9.8 224.66,162.56 227.2,165.1 SV17.9
N$285
  Bottom 0.508: IC9.9 210.06,162.56 207.52,165.1 SV18.1
N$286
  Bottom 0.508: IC9.10 209.42,160.02 207.52,161.93 SV18.2
N$287
  Bottom 0.508: IC9.11 208.79,157.48 207.52,158.75 SV18.3
N$288
  Bottom 0.508: IC9.12 206.88,154.94 SV18.4
N$289
  Bottom 0.508: SV18.5 IC9.13
N$290
  Bottom 0.508: IC9.14 206.88,149.86 SV18.6
N$291
  Bottom 0.508: IC9.15 208.79,147.32 207.52,146.05 SV18.7
N$292
  Bottom 0.508: IC9.16 209.42,144.78 207.52,142.88 SV18.8
N$295
  Bottom 0.508: IC10.1 225.3,176.53 227.2,174.62 SV19.2
N$296
  Bottom 0.508: IC10.2 225.93,179.07 227.2,177.8 SV19.3
N$297
  Bottom 0.508: IC10.3 227.84,181.61 SV19.4
N$298
  Bottom 0.508: IC10.4 SV19.5
N$299
  Bottom 0.508: IC10.5 227.84,186.69 SV19.6
N$300
  Bottom 0.508: IC10.6 225.93,189.23 227.2,190.5 SV19.7
N$301
  Bottom 0.508: IC10.7 225.3,191.77 227.2,193.68 SV19.8
N$302
  Bottom 0.508: IC10.8 224.66,194.31 227.2,196.85 SV19.9
N$303
  Bottom 0.508: IC10.9 210.06,194.31 207.52,196.85 SV20.1
N$304
  Bottom 0.508: IC10.10 209.42,191.77 207.52,193.68 SV20.2
N$305
  Bottom 0.508: IC10.11 208.79,189.23 207.52,190.5 SV20.3
N$306
  Bottom 0.508: IC10.12 206.88,186.69 SV20.4
N$307
  Bottom 0.508: SV20.5 IC10.13
N$308
  Bottom 0.508: IC10.14 206.88,181.61 SV20.6
N$309
  Bottom 0.508: IC10.15 208.79,179.07 207.52,177.8 SV20.7
N$310
  Bottom 0.508: IC10.16 209.42,176.53 207.52,174.62 SV20.8
N$313
  Bottom 0.508: IC11.1 196.72,49.53 198.63,47.62 SV21.2
N$314
  Bottom 0.508: IC11.2 197.36,52.07 198.63,50.8 SV21.3
N$315
  Bottom 0.508: IC11.3 199.26,54.61 SV21.4
N$316
  Bottom 0.508: SV21.5 IC11.4
N$317
  Bottom 0.508: IC11.5 199.26,59.69 SV21.6
N$318
  Bottom 0.508: IC11.6 197.36,62.23 198.63,63.5 SV21.7
N$319
  Bottom 0.508: IC11.7 196.72,64.77 198.63,66.67 SV21.8
N$320
  Bottom 0.508: IC11.8 196.09,67.31 198.63,69.85 SV21.9
N$321
  Bottom 0.508: IC11.9 181.48,67.31 178.94,69.85 SV22.1
N$322
  Bottom 0.508: IC11.10 180.85,64.77 178.94,66.67 SV22.2
N$323
  Bottom 0.508: IC11.11 180.21,62.23 178.94,63.5 SV22.3
N$324
  Bottom 0.508: IC11.12 178.31,59.69 SV22.4
N$325
  Bottom 0.508: SV22.5 IC11.13
N$326
  Bottom 0.508: IC11.14 178.31,54.61 SV22.6
N$327
  Bottom 0.508: IC11.15 180.21,52.07 178.94,50.8 SV22.7
N$328
  Bottom 0.508: IC11.16 180.85,49.53 178.94,47.62 SV22.8
N$331
  Bottom 0.508: IC12.1 196.72,81.28 198.63,79.38 SV23.2
N$332
  Bottom 0.508: IC12.2 197.36,83.82 198.63,82.55 SV23.3
N$333
  Bottom 0.508: IC12.3 199.26,86.36 SV23.4
N$334
  Bottom 0.508: IC12.4 SV23.5
N$335
  Bottom 0.508: IC12.5 199.26,91.44 SV23.6
N$336
  Bottom 0.508: IC12.6 197.36,93.98 198.63,95.25 SV23.7
N$337
  Bottom 0.508: IC12.7 196.72,96.52 198.63,98.42 SV23.8
N$338
  Bottom 0.508: IC12.8 196.09,99.06 198.63,101.6 SV23.9
N$339
  Bottom 0.508: IC12.9 181.48,99.06 178.94,101.6 SV24.1
N$340
  Bottom 0.508: IC12.10 180.85,96.52 178.94,98.42 SV24.2
N$341
  Bottom 0.508: IC12.11 180.21,93.98 178.94,95.25 SV24.3
N$342
  Bottom 0.508: IC12.12 178.31,91.44 SV24.4
N$343
  Bottom 0.508: SV24.5 IC12.13
N$344
  Bottom 0.508: IC12.14 178.31,86.36 SV24.6
N$345
  Bottom 0.508: IC12.15 180.21,83.82 178.94,82.55 SV24.7
N$346
  Bottom 0.508: IC12.16 180.85,81.28 178.94,79.38 SV24.8
N$349
  Bottom 0.508: IC13.1 196.72,113.03 198.63,111.12 SV25.2
N$350
  Bottom 0.508: IC13.2 197.36,115.57 198.63,114.3 SV25.3
N$351
  Bottom 0.508: IC13.3 199.26,118.11 SV25.4
N$352
  Bottom 0.508: IC13.4 SV25.5
N$353
  Bottom 0.508: IC13.5 199.26,123.19 SV25.6
N$354
  Bottom 0.508: IC13.6 197.36,125.73 198.63,127 SV25.7
N$355
  Bottom 0.508: IC13.7 196.72,128.27 198.63,130.18 SV25.8
N$356
  Bottom 0.508: IC13.8 196.09,130.81 198.63,133.35 SV25.9
N$357
  Bottom 0.508: IC13.9 181.48,130.81 178.94,133.35 SV26.1
N$358
  Bottom 0.508: IC13.10 180.85,128.27 178.94,130.18 SV26.2
N$359
  Bottom 0.508: IC13.11 180.21,125.73 178.94,127 SV26.3
N$360
  Bottom 0.508: IC13.12 178.31,123.19 SV26.4
N$361
  Bottom 0.508: SV26.5 IC13.13
N$362
  Bottom 0.508: IC13.14 178.31,118.11 SV26.6
N$363
  Bottom 0.508: IC13.15 180.21,115.57 178.94,114.3 SV26.7
N$364
  Bottom 0.508: IC13.16 180.85,113.03 178.94,111.12 SV26.8
N$367
  Bottom 0.508: IC14.1 196.72,144.78 198.63,142.88 SV27.2
N$368
  Bottom 0.508: IC14.2 197.36,147.32 198.63,146.05 SV27.3
N$369
  Bottom 0.508: IC14.3 199.26,149.86 SV27.4
N$370
  Bottom 0.508: IC14.4 SV27.5
N$371
  Bottom 0.508: IC14.5 199.26,154.94 SV27.6
N$372
  Bottom 0.508: IC14.6 197.36,157.48 198.63,158.75 SV27.7
N$373
  Bottom 0.508: IC14.7 196.72,160.02 198.63,161.93 SV27.8
N$374
  Bottom 0.508: IC14.8 196.09,162.56 198.63,165.1 SV27.9
N$375
  Bottom 0.508: IC14.9 181.48,162.56 178.94,165.1 SV28.1
N$376
  Bottom 0.508: IC14.10 180.85,160.02 178.94,161.93 SV28.2
N$377
  Bottom 0.508: IC14.11 180.21,157.48 178.94,158.75 SV28.3
N$378
  Bottom 0.508: IC14.12 178.31,154.94 SV28.4
N$379
  Bottom 0.508: SV28.5 IC14.13
N$380
  Bottom 0.508: IC14.14 178.31,149.86 SV28.6
N$381
  Bottom 0.508: IC14.15 180.21,147.32 178.94,146.05 SV28.7
N$382
  Bottom 0.508: IC14.16 180.85,144.78 178.94,142.88 SV28.8
N$385
  Bottom 0.508: IC15.1 196.72,176.53 198.63,174.62 SV29.2
N$386
  Bottom 0.508: IC15.2 197.36,179.07 198.63,177.8 SV29.3
N$387
  Bottom 0.508: IC15.3 199.26,181.61 SV29.4
N$388
  Bottom 0.508: IC15.4 SV29.5
N$389
  Bottom 0.508: IC15.5 199.26,186.69 SV29.6
N$390
  Bottom 0.508: IC15.6 197.36,189.23 198.63,190.5 SV29.7
N$391
  Bottom 0.508: IC15.7 196.72,191.77 198.63,193.68 SV29.8
N$392
  Bottom 0.508: IC15.8 196.09,194.31 198.63,196.85 SV29.9
N$393
  Bottom 0.508: IC15.9 181.48,194.31 178.94,196.85 SV30.1
N$394
  Bottom 0.508: IC15.10 180.85,191.77 178.94,193.68 SV30.2
N$395
  Bottom 0.508: IC15.11 180.21,189.23 178.94,190.5 SV30.3
N$396
  Bottom 0.508: IC15.12 178.31,186.69 SV30.4
N$397
  Bottom 0.508: SV30.5 IC15.13
N$398
  Bottom 0.508: IC15.14 178.31,181.61 SV30.6
N$399
  Bottom 0.508: IC15.15 180.21,179.07 178.94,177.8 SV30.7
N$400
  Bottom 0.508: IC15.16 180.85,176.53 178.94,174.62 SV30.8
N$403
  Bottom 0.508: IC16.1 82.42,49.53 84.33,47.62 SV31.2
N$404
  Bottom 0.508: IC16.2 83.06,52.07 84.33,50.8 SV31.3
N$405
  Bottom 0.508: IC16.3 84.96,54.61 SV31.4
N$406
  Bottom 0.508: IC16.4 SV31.5
N$407
  Bottom 0.508: IC16.5 84.96,59.69 SV31.6
N$408
  Bottom 0.508: IC16.6 83.06,62.23 84.33,63.5 SV31.7
N$409
  Bottom 0.508: IC16.7 82.42,64.77 84.33,66.67 SV31.8
N$410
  Bottom 0.508: IC16.8 81.79,67.31 84.33,69.85 SV31.9
N$411
  Bottom 0.508: IC16.9 67.18,67.31 64.64,69.85 SV32.1
N$412
  Bottom 0.508: IC16.10 66.55,64.77 64.64,66.67 SV32.2
N$413
  Bottom 0.508: IC16.11 65.91,62.23 64.64,63.5 SV32.3
N$414
  Bottom 0.508: IC16.12 64.01,59.69 SV32.4
N$415
  Bottom 0.508: SV32.5 IC16.13
N$416
  Bottom 0.508: IC16.14 64.01,54.61 SV32.6
N$417
  Bottom 0.508: IC16.15 65.91,52.07 64.64,50.8 SV32.7
N$418
  Bottom 0.508: IC16.16 66.55,49.53 64.64,47.62 SV32.8
N$421
  Bottom 0.508: IC17.1 82.42,81.28 84.33,79.38 SV33.2
N$422
  Bottom 0.508: IC17.2 83.06,83.82 84.33,82.55 SV33.3
N$423
  Bottom 0.508: IC17.3 84.96,86.36 SV33.4
N$424
  Bottom 0.508: IC17.4 SV33.5
N$425
  Bottom 0.508: IC17.5 84.96,91.44 SV33.6
N$426
  Bottom 0.508: IC17.6 83.06,93.98 84.33,95.25 SV33.7
N$427
  Bottom 0.508: IC17.7 82.42,96.52 84.33,98.42 SV33.8
N$428
  Bottom 0.508: IC17.8 81.79,99.06 84.33,101.6 SV33.9
N$429
  Bottom 0.508: IC17.9 67.18,99.06 64.64,101.6 SV34.1
N$430
  Bottom 0.508: IC17.10 66.55,96.52 64.64,98.42 SV34.2
N$431
  Bottom 0.508: IC17.11 65.91,93.98 64.64,95.25 SV34.3
N$432
  Bottom 0.508: IC17.12 64.01,91.44 SV34.4
N$433
  Bottom 0.508: SV34.5 IC17.13
N$434
  Bottom 0.508: IC17.14 64.01,86.36 SV34.6
N$435
  Bottom 0.508: IC17.15 65.91,83.82 64.64,82.55 SV34.7
N$436
  Bottom 0.508: IC17.16 66.55,81.28 64.64,79.38 SV34.8
N$439
  Bottom 0.508: IC18.1 82.42,113.03 84.33,111.12 SV35.2
N$440
  Bottom 0.508: IC18.2 83.06,115.57 84.33,114.3 SV35.3
N$441
  Bottom 0.508: IC18.3 84.96,118.11 SV35.4
N$442
  Bottom 0.508: IC18.4 SV35.5
N$443
  Bottom 0.508: IC18.5 84.96,123.19 SV35.6
N$444
  Bottom 0.508: IC18.6 83.06,125.73 84.33,127 SV35.7
N$445
  Bottom 0.508: IC18.7 82.42,128.27 84.33,130.18 SV35.8
N$446
  Bottom 0.508: IC18.8 81.79,130.81 84.33,133.35 SV35.9
N$447
  Bottom 0.508: IC18.9 67.18,130.81 64.64,133.35 SV36.1
N$448
  Bottom 0.508: IC18.10 66.55,128.27 64.64,130.18 SV36.2
N$449
  Bottom 0.508: IC18.11 65.91,125.73 64.64,127 SV36.3
N$450
  Bottom 0.508: IC18.12 64.01,123.19 SV36.4
N$451
  Bottom 0.508: SV36.5 IC18.13
N$452
  Bottom 0.508: IC18.14 64.01,118.11 SV36.6
N$453
  Bottom 0.508: IC18.15 65.91,115.57 64.64,114.3 SV36.7
N$454
  Bottom 0.508: IC18.16 66.55,113.03 64.64,111.12 SV36.8
N$457
  Bottom 0.508: IC19.1 82.42,144.78 84.33,142.88 SV37.2
N$458
  Bottom 0.508: IC19.2 83.06,147.32 84.33,146.05 SV37.3
N$459
  Bottom 0.508: IC19.3 84.96,149.86 SV37.4
N$460
  Bottom 0.508: IC19.4 SV37.5
N$461
  Bottom 0.508: IC19.5 84.96,154.94 SV37.6
N$462
  Bottom 0.508: IC19.6 83.06,157.48 84.33,158.75 SV37.7
N$463
  Bottom 0.508: IC19.7 82.42,160.02 84.33,161.93 SV37.8
N$464
  Bottom 0.508: IC19.8 81.79,162.56 84.33,165.1 SV37.9
N$465
  Bottom 0.508: IC19.9 67.18,162.56 64.64,165.1 SV38.1
N$466
  Bottom 0.508: IC19.10 66.55,160.02 64.64,161.93 SV38.2
N$467
  Bottom 0.508: IC19.11 65.91,157.48 64.64,158.75 SV38.3
N$468
  Bottom 0.508: IC19.12 64.01,154.94 SV38.4
N$469
  Bottom 0.508: SV38.5 IC19.13
N$470
  Bottom 0.508: IC19.14 64.01,149.86 SV38.6
N$471
  Bottom 0.508: IC19.15 65.91,147.32 64.64,146.05 SV38.7
N$472
  Bottom 0.508: IC19.16 66.55,144.78 64.64,142.88 SV38.8
N$475
  Bottom 0.508: IC20.1 83.06,175.9 84.33,174.62 SV39.2
N$476
  Bottom 0.508: IC20.2 84.96,178.44 SV39.3
N$477
  Bottom 0.508: IC20.3 SV39.4
N$478
  Bottom 0.508: IC20.4 84.96,183.51 SV39.5
N$479
  Bottom 0.508: IC20.5 83.06,186.06 84.33,187.32 SV39.6
N$480
  Bottom 0.508: IC20.6 82.42,188.59 84.33,190.5 SV39.7
N$481
  Bottom 0.508: IC20.7 81.79,191.13 84.33,193.68 SV39.8
N$482
  Bottom 0.508: IC20.8 81.15,193.68 84.33,196.85 SV39.9
N$483
  Bottom 0.508: IC20.9 67.82,193.68 64.64,196.85 SV40.1
N$484
  Bottom 0.508: IC20.10 67.18,191.13 64.64,193.68 SV40.2
N$485
  Bottom 0.508: IC20.11 66.55,188.59 64.64,190.5 SV40.3
N$486
  Bottom 0.508: IC20.12 65.91,186.06 64.64,187.32 SV40.4
N$487
  Bottom 0.508: IC20.13 64.01,183.51 SV40.5
N$488
  Bottom 0.508: SV40.6 IC20.14
N$489
  Bottom 0.508: IC20.15 64.01,178.44 SV40.7
N$490
  Bottom 0.508: IC20.16 65.91,175.9 64.64,174.62 SV40.8
N$493
  Bottom 0.508: IC21.1 53.85,49.53 55.75,47.62 SV41.2
N$494
  Bottom 0.508: IC21.2 54.48,52.07 55.75,50.8 SV41.3
N$495
  Bottom 0.508: IC21.3 56.39,54.61 SV41.4
N$496
  Bottom 0.508: IC21.4 SV41.5
N$497
  Bottom 0.508: IC21.5 56.39,59.69 SV41.6
N$498
  Bottom 0.508: IC21.6 54.48,62.23 55.75,63.5 SV41.7
N$499
  Bottom 0.508: IC21.7 53.85,64.77 55.75,66.67 SV41.8
N$500
  Bottom 0.508: IC21.8 53.21,67.31 55.75,69.85 SV41.9
N$501
  Bottom 0.508: IC21.9 38.61,67.31 36.07,69.85 SV42.1
N$502
  Bottom 0.508: IC21.10 37.97,64.77 36.07,66.67 SV42.2
N$503
  Bottom 0.508: IC21.11 37.34,62.23 36.07,63.5 SV42.3
N$504
  Bottom 0.508: IC21.12 35.43,59.69 SV42.4
N$505
  Bottom 0.508: SV42.5 IC21.13
N$506
  Bottom 0.508: IC21.14 35.43,54.61 SV42.6
N$507
  Bottom 0.508: IC21.15 37.34,52.07 36.07,50.8 SV42.7
N$508
  Bottom 0.508: IC21.16 37.97,49.53 36.07,47.62 SV42.8
N$511
  Bottom 0.508: IC22.1 53.85,81.28 55.75,79.38 SV43.2
N$512
  Bottom 0.508: IC22.2 54.48,83.82 55.75,82.55 SV43.3
N$513
  Bottom 0.508: IC22.3 56.39,86.36 SV43.4
N$514
  Bottom 0.508: IC22.4 SV43.5
N$515
  Bottom 0.508: IC22.5 56.39,91.44 SV43.6
N$516
  Bottom 0.508: IC22.6 54.48,93.98 55.75,95.25 SV43.7
N$517
  Bottom 0.508: IC22.7 53.85,96.52 55.75,98.42 SV43.8
N$518
  Bottom 0.508: IC22.8 53.21,99.06 55.75,101.6 SV43.9
N$519
  Bottom 0.508: IC22.9 38.61,99.06 36.07,101.6 SV44.1
N$520
  Bottom 0.508: IC22.10 37.97,96.52 36.07,98.42 SV44.2
N$521
  Bottom 0.508: IC22.11 37.34,93.98 36.07,95.25 SV44.3
N$522
  Bottom 0.508: IC22.12 35.43,91.44 SV44.4
N$523
  Bottom 0.508: SV44.5 IC22.13
N$524
  Bottom 0.508: IC22.14 35.43,86.36 SV44.6
N$525
  Bottom 0.508: IC22.15 37.34,83.82 36.07,82.55 SV44.7
N$526
  Bottom 0.508: IC22.16 37.97,81.28 36.07,79.38 SV44.8
N$529
  Bottom 0.508: IC23.1 53.85,113.03 55.75,111.12 SV45.2
N$530
  Bottom 0.508: IC23.2 54.48,115.57 55.75,114.3 SV45.3
N$531
  Bottom 0.508: IC23.3 56.39,118.11 SV45.4
N$532
  Bottom 0.508: IC23.4 SV45.5
N$533
  Bottom 0.508: IC23.5 56.39,123.19 SV45.6
N$534
  Bottom 0.508: IC23.6 54.48,125.73 55.75,127 SV45.7
N$535
  Bottom 0.508: IC23.7 53.85,128.27 55.75,130.18 SV45.8
N$536
  Bottom 0.508: IC23.8 53.21,130.81 55.75,133.35 SV45.9
N$537
  Bottom 0.508: IC23.9 38.61,130.81 36.07,133.35 SV46.1
N$538
  Bottom 0.508: IC23.10 37.97,128.27 36.07,130.18 SV46.2
N$539
  Bottom 0.508: IC23.11 37.34,125.73 36.07,127 SV46.3
N$540
  Bottom 0.508: IC23.12 35.43,123.19 SV46.4
N$541
  Bottom 0.508: SV46.5 IC23.13
N$542
  Bottom 0.508: IC23.14 35.43,118.11 SV46.6
N$543
  Bottom 0.508: IC23.15 37.34,115.57 36.07,114.3 SV46.7
N$544
  Bottom 0.508: IC23.16 37.97,113.03 36.07,111.12 SV46.8
N$547
  Bottom 0.508: IC24.1 53.85,144.78 55.75,142.88 SV47.2
N$548
  Bottom 0.508: IC24.2 54.48,147.32 55.75,146.05 SV47.3
N$549
  Bottom 0.508: IC24.3 56.39,149.86 SV47.4
N$550
  Bottom 0.508: IC24.4 SV47.5
N$551
  Bottom 0.508: IC24.5 56.39,154.94 SV47.6
N$552
  Bottom 0.508: IC24.6 54.48,157.48 55.75,158.75 SV47.7
N$553
  Bottom 0.508: IC24.7 53.85,160.02 55.75,161.93 SV47.8
N$554
  Bottom 0.508: IC24.8 53.21,162.56 55.75,165.1 SV47.9
N$555
  Bottom 0.508: IC24.9 38.61,162.56 36.07,165.1 SV48.1
N$556
  Bottom 0.508: IC24.10 37.97,160.02 36.07,161.93 SV48.2
N$557
  Bottom 0.508: IC24.11 37.34,157.48 36.07,158.75 SV48.3
N$558
  Bottom 0.508: IC24.12 35.43,154.94 SV48.4
N$559
  Bottom 0.508: SV48.5 IC24.13
N$560
  Bottom 0.508: IC24.14 35.43,149.86 SV48.6
N$561
  Bottom 0.508: IC24.15 37.34,147.32 36.07,146.05 SV48.7
N$562
  Bottom 0.508: IC24.16 37.97,144.78 36.07,142.88 SV48.8
N$565
  Bottom 0.508: IC25.1 53.85,176.53 55.75,174.62 SV49.2
N$566
  Bottom 0.508: IC25.2 54.48,179.07 55.75,177.8 SV49.3
N$567
  Bottom 0.508: IC25.3 56.39,181.61 SV49.4
N$568
  Bottom 0.508: IC25.4 SV49.5
N$569
  Bottom 0.508: IC25.5 56.39,186.69 SV49.6
N$570
  Bottom 0.508: IC25.6 54.48,189.23 55.75,190.5 SV49.7
N$571
  Bottom 0.508: IC25.7 53.85,191.77 55.75,193.68 SV49.8
N$572
  Bottom 0.508: IC25.8 53.21,194.31 55.75,196.85 SV49.9
N$573
  Bottom 0.508: IC25.9 38.61,194.31 36.07,196.85 SV50.1
N$574
  Bottom 0.508: IC25.10 37.97,191.77 36.07,193.68 SV50.2
N$575
  Bottom 0.508: IC25.11 37.34,189.23 36.07,190.5 SV50.3
N$576
  Bottom 0.508: IC25.12 35.43,186.69 SV50.4
N$577
  Bottom 0.508: SV50.5 IC25.13
N$578
  Bottom 0.508: IC25.14 35.43,181.61 SV50.6
N$579
  Bottom 0.508: IC25.15 37.34,179.07 36.07,177.8 SV50.7
N$580
  Bottom 0.508: IC25.16 37.97,176.53 36.07,174.62 SV50.8
N$583
  Bottom 0.508: IC26.1 25.27,49.53 27.18,47.62 SV51.2
N$584
  Bottom 0.508: IC26.2 25.91,52.07 27.18,50.8 SV51.3
N$585
  Bottom 0.508: IC26.3 27.81,54.61 SV51.4
N$586
  Bottom 0.508: IC26.4 SV51.5
N$587
  Bottom 0.508: IC26.5 27.81,59.69 SV51.6
N$588
  Bottom 0.508: IC26.6 25.91,62.23 27.18,63.5 SV51.7
N$589
  Bottom 0.508: IC26.7 25.27,64.77 27.18,66.67 SV51.8
N$590
  Bottom 0.508: IC26.8 24.64,67.31 27.18,69.85 SV51.9
N$591
  Bottom 0.508: IC26.9 10.03,67.31 7.49,69.85 SV52.1
N$592
  Bottom 0.508: IC26.10 9.4,64.77 7.49,66.67 SV52.2
N$593
  Bottom 0.508: IC26.11 8.76,62.23 7.49,63.5 SV52.3
N$594
  Bottom 0.508: IC26.12 6.86,59.69 SV52.4
N$595
  Bottom 0.508: SV52.5 IC26.13
N$596
  Bottom 0.508: IC26.14 6.86,54.61 SV52.6
N$597
  Bottom 0.508: IC26.15 8.76,52.07 7.49,50.8 SV52.7
N$598
  Bottom 0.508: IC26.16 9.4,49.53 7.49,47.62 SV52.8
N$601
  Bottom 0.508: IC27.1 25.27,81.28 27.18,79.38 SV53.2
N$602
  Bottom 0.508: IC27.2 25.91,83.82 27.18,82.55 SV53.3
N$603
  Bottom 0.508: IC27.3 27.81,86.36 SV53.4
N$604
  Bottom 0.508: IC27.4 SV53.5
N$605
  Bottom 0.508: IC27.5 27.81,91.44 SV53.6
N$606
  Bottom 0.508: IC27.6 25.91,93.98 27.18,95.25 SV53.7
N$607
  Bottom 0.508: IC27.7 25.27,96.52 27.18,98.42 SV53.8
N$608
  Bottom 0.508: IC27.8 24.64,99.06 27.18,101.6 SV53.9
N$609
  Bottom 0.508: IC27.9 10.03,99.06 7.49,101.6 SV54.1
N$610
  Bottom 0.508: IC27.10 9.4,96.52 7.49,98.42 SV54.2
N$611
  Bottom 0.508: IC27.11 8.76,93.98 7.49,95.25 SV54.3
N$612
  Bottom 0.508: IC27.12 6.86,91.44 SV54.4
N$613
  Bottom 0.508: SV54.5 IC27.13
N$614
  Bottom 0.508: IC27.14 6.86,86.36 SV54.6
N$615
  Bottom 0.508: IC27.15 8.76,83.82 7.49,82.55 SV54.7
N$616
  Bottom 0.508: IC27.16 9.4,81.28 7.49,79.38 SV54.8
N$619
  Bottom 0.508: IC28.1 25.27,113.03 27.18,111.12 SV55.2
N$620
  Bottom 0.508: IC28.2 25.91,115.57 27.18,114.3 SV55.3
N$621
  Bottom 0.508: IC28.3 27.81,118.11 SV55.4
N$622
  Bottom 0.508: IC28.4 SV55.5
N$623
  Bottom 0.508: IC28.5 27.81,123.19 SV55.6
N$624
  Bottom 0.508: IC28.6 25.91,125.73 27.18,127 SV55.7
N$625
  Bottom 0.508: IC28.7 25.27,128.27 27.18,130.18 SV55.8
N$626
  Bottom 0.508: IC28.8 24.64,130.81 27.18,133.35 SV55.9
N$627
  Bottom 0.508: IC28.9 10.03,130.81 7.49,133.35 SV56.1
N$628
  Bottom 0.508: IC28.10 9.4,128.27 7.49,130.18 SV56.2
N$629
  Bottom 0.508: IC28.11 8.76,125.73 7.49,127 SV56.3
N$630
  Bottom 0.508: IC28.12 6.86,123.19 SV56.4
N$631
  Bottom 0.508: SV56.5 IC28.13
N$632
  Bottom 0.508: IC28.14 6.86,118.11 SV56.6
N$633
  Bottom 0.508: IC28.15 8.76,115.57 7.49,114.3 SV56.7
N$634
  Bottom 0.508: IC28.16 9.4,113.03 7.49,111.12 SV56.8
N$637
  Bottom 0.508: IC29.1 25.27,144.78 27.18,142.88 SV57.2
N$638
  Bottom 0.508: IC29.2 25.91,147.32 27.18,146.05 SV57.3
N$639
  Bottom 0.508: IC29.3 27.81,149.86 SV57.4
N$640
  Bottom 0.508: IC29.4 SV57.5
N$641
  Bottom 0.508: IC29.5 27.81,154.94 SV57.6
N$642
  Bottom 0.508: IC29.6 25.91,157.48 27.18,158.75 SV57.7
N$643
  Bottom 0.508: IC29.7 25.27,160.02 27.18,161.93 SV57.8
N$644
  Bottom 0.508: IC29.8 24.64,162.56 27.18,165.1 SV57.9
N$645
  Bottom 0.508: IC29.9 10.03,162.56 7.49,165.1 SV58.1
N$646
  Bottom 0.508: IC29.10 9.4,160.02 7.49,161.93 SV58.2
N$647
  Bottom 0.508: IC29.11 8.76,157.48 7.49,158.75 SV58.3
N$648
  Bottom 0.508: IC29.12 6.86,154.94 SV58.4
N$649
  Bottom 0.508: SV58.5 IC29.13
N$650
  Bottom 0.508: IC29.14 6.86,149.86 SV58.6
N$651
  Bottom 0.508: IC29.15 8.76,147.32 7.49,146.05 SV58.7
N$652
  Bottom 0.508: IC29.16 9.4,144.78 7.49,142.88 SV58.8
N$655
  Bottom 0.508: IC30.1 25.27,176.53 27.18,174.62 SV59.2
N$656
  Bottom 0.508: IC30.2 25.91,179.07 27.18,177.8 SV59.3
N$657
  Bottom 0.508: IC30.3 27.81,181.61 SV59.4
N$658
  Bottom 0.508: IC30.4 SV59.5
N$659
  Bottom 0.508: IC30.5 27.81,186.69 SV59.6
N$660
  Bottom 0.508: IC30.6 25.91,189.23 27.18,190.5 SV59.7
N$661
  Bottom 0.508: IC30.7 25.27,191.77 27.18,193.68 SV59.8
N$662
  Bottom 0.508: IC30.8 24.64,194.31 27.18,196.85 SV59.9
N$663
  Bottom 0.508: IC30.9 10.03,194.31 7.49,196.85 SV60.1
N$664
  Bottom 0.508: IC30.10 9.4,191.77 7.49,193.68 SV60.2
N$665
  Bottom 0.508: IC30.11 8.76,189.23 7.49,190.5 SV60.3
N$666
  Bottom 0.508: IC30.12 6.86,186.69 SV60.4
N$667
  Bottom 0.508: SV60.5 IC30.13
N$668
  Bottom 0.508: IC30.14 6.86,181.61 SV60.6
N$669
  Bottom 0.508: IC30.15 8.76,179.07 7.49,177.8 SV60.7
N$670
  Bottom 0.508: IC30.16 9.4,176.53 7.49,174.62 SV60.8
N$673
  Bottom 0.508: SV61.2 136.4,48.9 140.21,52.7 IC31.1 IC39.1
N$674
  Bottom 0.508: SV61.3 139.57,49.53 142.75,52.7 IC31.2 IC39.2
N$675
  Bottom 0.508: SV61.4 142.75,48.9 145.29,51.44 IC31.3 IC39.3
N$676
  Bottom 0.508: SV61.5 145.92,48.9 147.83,50.8 IC31.4 IC39.4
N$677
  Bottom 0.508: SV61.6 149.1,48.9 150.37,50.16 IC31.5 IC39.5
N$678
  Bottom 0.508: SV61.7 152.91,48.26 IC31.6 IC39.6
N$679
  Bottom 0.508: SV61.8 IC31.7 IC39.7
N$680
  Bottom 0.508: SV61.9 157.99,48.26 IC31.8 IC39.8
N$681